# EAGLE design 318_PCB_FOR (EAGLE 7.6.0)
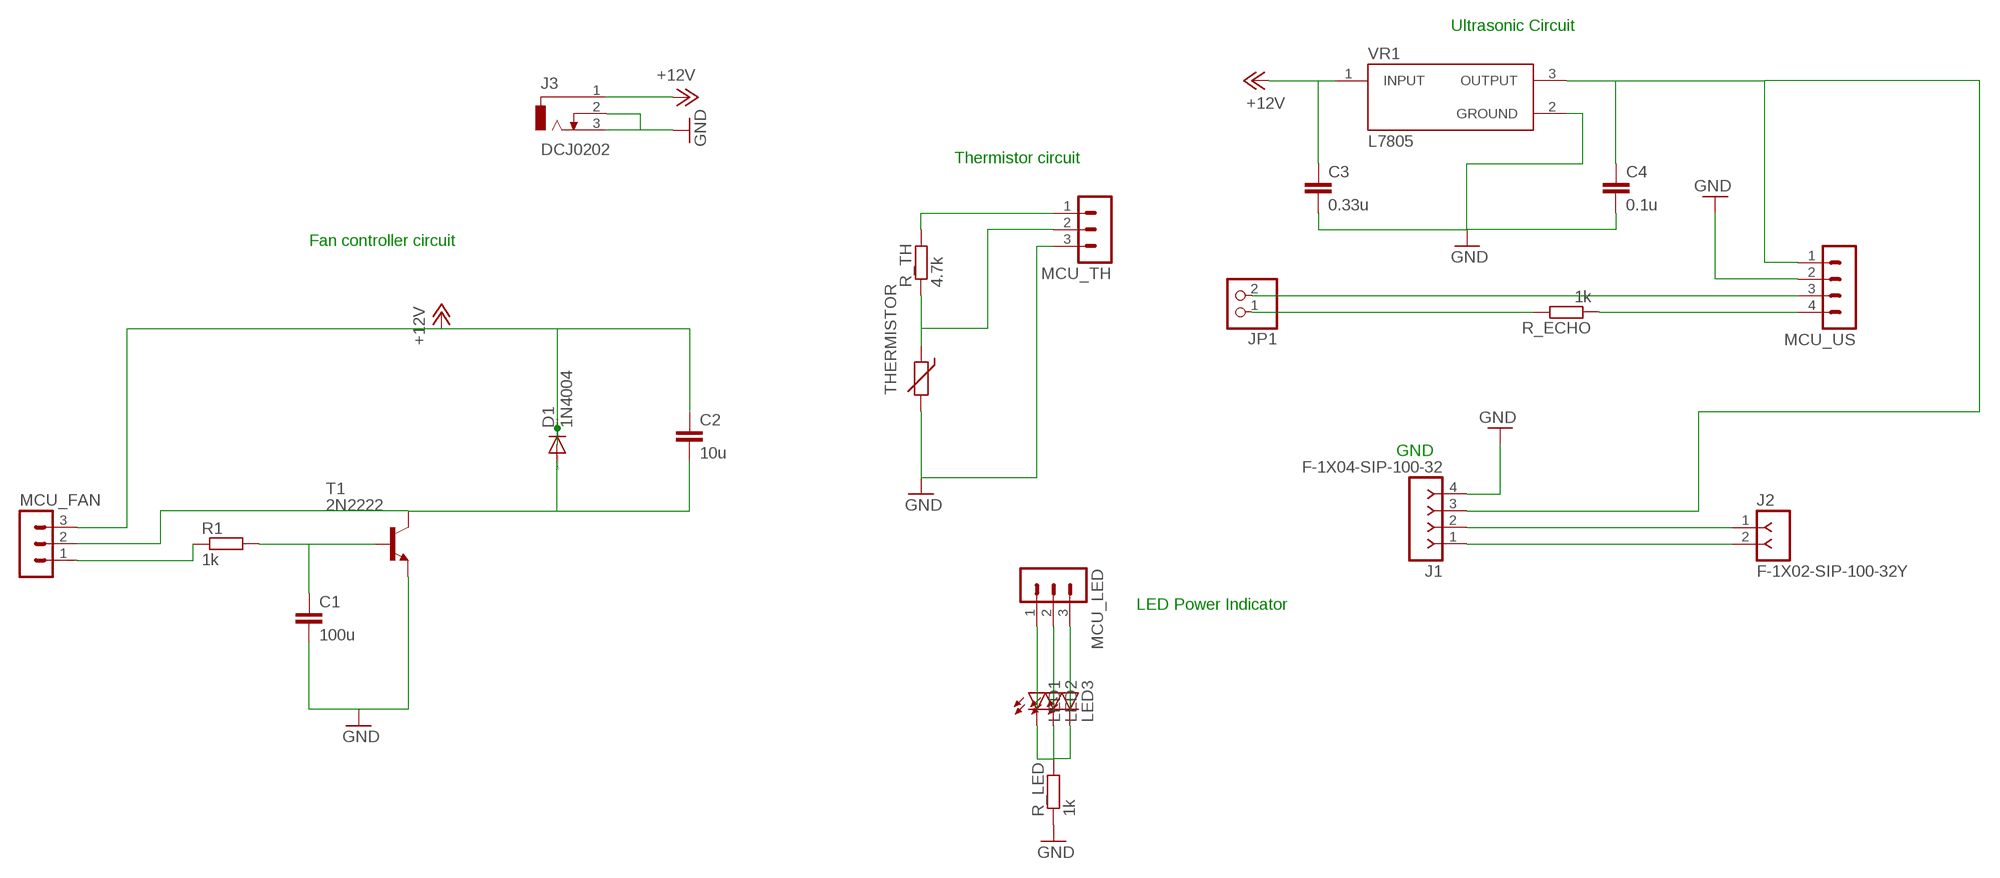
[diagram p0: schematic, sheet 1]

## Parts
C1  100u  C-EU025-025X050  [C025-025X050]
C2  10u  C-EU025-025X050  [C025-025X050]
C3  0.33u  C-EU025-025X050  [C025-025X050]
C4  0.1u  C-EU025-025X050  [C025-025X050]
D1  1N4004  [DO41-10]
J1  F-1X04-SIP-100-32  [SIP-100-04-32]
J2  F-1X02-SIP-100-32Y  [SIP-100-02-32Y]
J3  DCJ0202  [DCJ0202]
JP1  PINHD-1X2  [1X02]
LED1  LEDSFH480  [SFH480]
LED2  LEDSFH480  [SFH480]
LED3  LEDSFH480  [SFH480]
MCU_FAN  MA03-1  [MA03-1]
MCU_LED  MA03-1  [MA03-1]
MCU_TH  MA03-1  [MA03-1]
MCU_US  MA04-1  [MA04-1]
R1  1k  R-EU_0207/10  [0207/10]
R_ECHO  1k  R-EU_0207/10  [0207/10]
R_LED  1k  R-EU_0207/10  [0207/10]
R_TH  4.7k  R-EU_0207/10  [0207/10]
T1  2N2222  [TO18]
THERMISTOR  THERMISTOR-5  [R-5]
VR1  L7805  [TO255P1020X450X2000-3]

## Nets
3V3: MCU_TH.1 R_TH.2
+12V: C2.1 C3.1 D1.C J3.1 MCU_FAN.3 VR1.1(INPUT)
AMBER: LED2.A MCU_LED.2
FAN_BLACK: C2.2 D1.A MCU_FAN.2 T1.3(C)
GND: C1.2 C3.2 C4.2 J1.4 J3.2 J3.3 MCU_TH.3 MCU_US.2 R_LED.1 T1.1(E) THERMISTOR.2 VR1.2(GROUND)
GREEN: LED1.A MCU_LED.1
N$1: C1.1 R1.2 T1.2(B)
N$3: MCU_US.4 R_ECHO.1
N$4: LED1.K(C) LED2.K(C) LED3.K(C) R_LED.2
N$5: JP1.2 MCU_US.3
N$6: C4.1 J1.3 MCU_US.1 VR1.3(OUTPUT)
N$7: JP1.1 R_ECHO.2
N$8: J1.1 J2.2
N$9: J1.2 J2.1
P1.6: MCU_FAN.1 R1.1
P8.1: MCU_TH.2 R_TH.1 THERMISTOR.1
RED: LED3.A MCU_LED.3

## Notes on the sheet
- Ultrasonic Circuit
- Thermistor circuit
- Fan controller circuit
- GND
- LED Power Indicator

## Library data of the parts
C1-C4 = rcl:C-EU: CAPACITOR, European symbol
D1 = diode:1N4004: DIODE general purpose rectifier, 1 A
J1 = con-headers-jp:F-1X04-: FEMALE HEADER
J2 = con-headers-jp:F-1X02-: FEMALE HEADER
J3 = con-jack:DCJ0202: DC POWER JACK Source: DCJ0202.pdf; OC_FARNELL: unknown; OC_NEWARK: unknown
JP1 = pinhead:PINHD-1X2: PIN HEADER
LED1-LED3 = led:LED: LED OSRAM: - CHIPLED LG R971, LG N971, LY N971, LG Q971, LY Q971, LO R971, LY R971 LH N974, LH R974 LS Q976, LO Q976, LY Q976 LO Q996 - Hyper CHIPLED LW Q18S LB Q993, LB Q99A, LB R99A - SideLED LS A670, LO A670, LY A670, LG A670, LP A670 LB A673, LV A673, LT A673, LW A673 LH A674 LY A675 LS A676, LA A676, LO A676, LY A676, LW A676 LS A679, LY A679, LG A679 - Hyper Micro SIDELED® LS Y876, LA Y876, LO Y876, LY Y876 LT Y87S - SmartLED LW L88C, LW L88S LB L89C, LB L89S, LG L890 LS L89K, LO L89K, LY L89K LS L896, LA L896, LO L896, LY L896 - TOPLED LS T670, LO T670, LY T670, LG T670, LP T670 LSG T670, LSP T670, LSY T670, LOP T670, LYG T670 LG T671, LOG T671, LSG T671 LB T673, LV T673, LT T673, LW T673 LH T674 LS T676, LA T676, LO T676, LY T676, LB T676, LH T676, LSB T676, LW T676 LB T67C, LV T67C, LT T67C, LS T67K, LO T67K, LY T67K, LW E67C LS E67B, LA E67B, LO E67B, LY E67B, LB E67C, LV E67C, LT E67C LW T67C LS T679, LY T679, LG T679 LS T770, LO T770, LY T770, LG T770, LP T770 LB T773, LV T773, LT T773, LW T773 LH T774 LS E675, LA E675, LY E675, LS T675 LS T776, LA T776, LO T776, LY T776, LB T776 LHGB T686 LT T68C, LB T68C - Hyper Mini TOPLED® LB M676 - Mini TOPLED Santana® LG M470 LS M47K, LO M47K, LY M47K Source: http://www.osram.convergy.de LUXEON: - LUMILED® LXK2-PW12-R00, LXK2-PW12-S00, LXK2-PW14-U00, LXK2-PW14-V00 LXK2-PM12-R00, LXK2-PM12-S00, LXK2-PM14-U00 LXK2-PE12-Q00, LXK2-PE12-R00, LXK2-PE12-S00, LXK2-PE14-T00, LXK2-PE14-U00 LXK2-PB12-K00, LXK2-PB12-L00, LXK2-PB12-M00, LXK2-PB14-N00, LXK2-PB14-P00, LXK2-PB14-Q00 LXK2-PR12-L00, LXK2-PR12-M00, LXK2-PR14-Q00, LXK2-PR14-R00 LXK2-PD12-Q00, LXK2-PD12-R00, LXK2-PD12-S00 LXK2-PH12-R00, LXK2-PH12-S00 LXK2-PL12-P00, LXK2-PL12-Q00, LXK2-PL12-R00 Source: www.luxeon.com KINGBRIGHT: KA-3528ASYC Source: www.kingbright.com
MCU_FAN MCU_LED MCU_TH = con-lstb:MA03-1: PIN HEADER; OC_FARNELL: unknown; OC_NEWARK: unknown
MCU_US = con-lstb:MA04-1: PIN HEADER; OC_FARNELL: unknown; OC_NEWARK: unknown
R1 R_ECHO R_LED R_TH = rcl:R-EU_: RESISTOR, European symbol
T1 = transistor-neu-to92:2N2222: NPN TRANSISTOR
THERMISTOR = varistor:THERMISTOR: THERMISTOR
VR1 = L7805:L7805: Check availability <https://pricing.snapeda.com/parts/L7805/STMicroelectronics/view-part?ref=eda>; AVAILABILITY: In Stock; CHECK_PRICES: https://www.snapeda.com/parts/L7805/STMicroelectronics/view-part/?ref=eda; DESCRIPTION: Standard Regulator Pos 5V 1.5A 3-Pin(3+Tab) TO-220FP Tube; MF: STMicroelectronics; MP: L7805; PACKAGE: None; PRICE: None; SNAPEDA_LINK: https://www.snapeda.com/parts/L7805/STMicroelectronics/view-part/?ref=snap

## Board
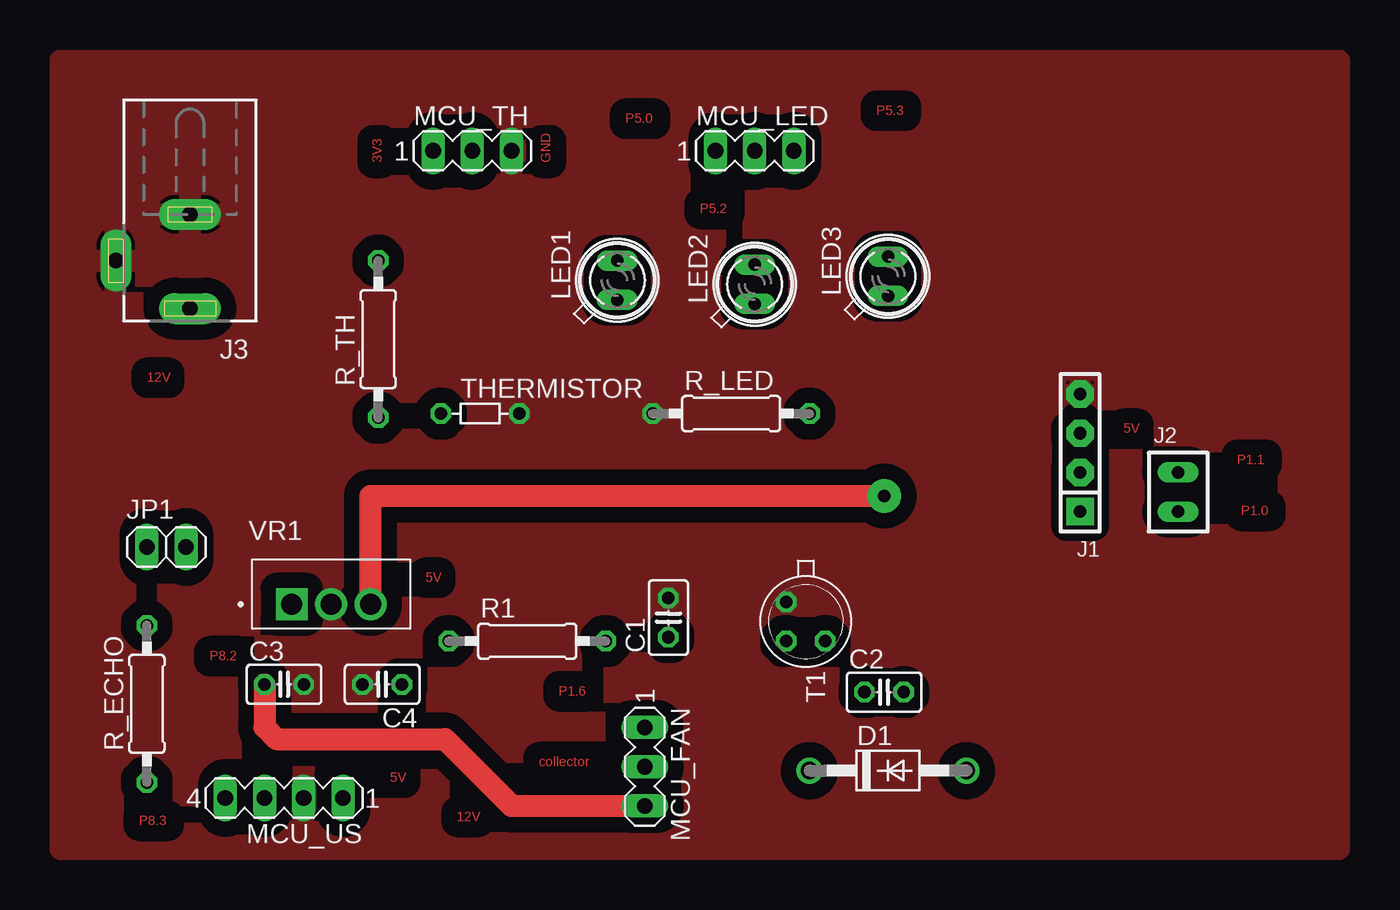
[diagram p1: board, top side]
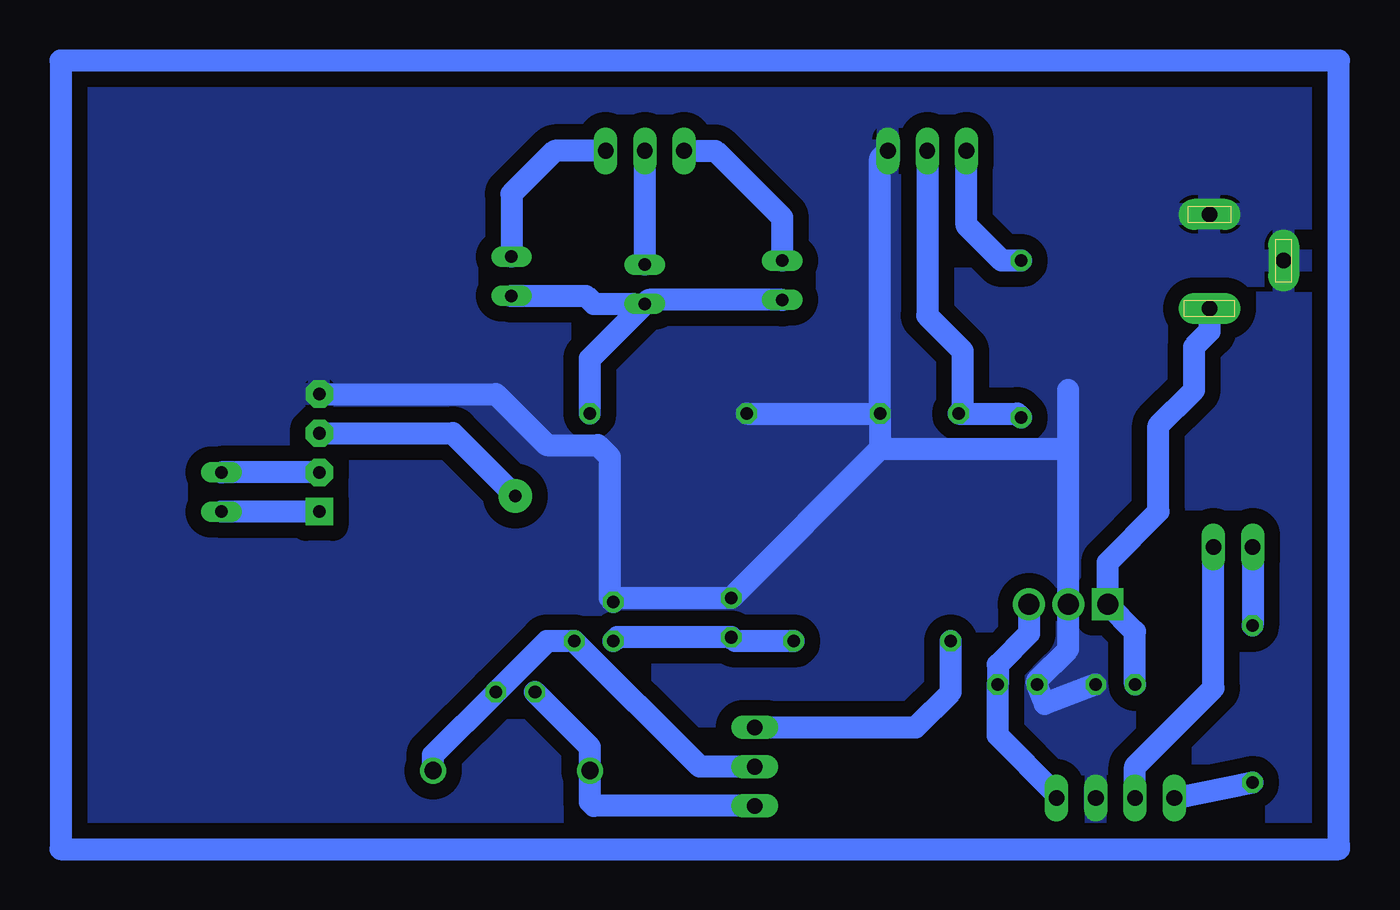
[diagram p2: board, bottom side, seen from below]

No outline drawn. Coordinates in mm, seen from the top.
Copper layers (1*16): Top 0.035mm / dielectric 1.5mm / Bottom 0.035mm
Design rules "default *": minimum track width 10mil, minimum drill 24mil, track to track 1mm, track to pad 1mm, pad to pad 1mm, via to via 1mm, smd to smd 8mil, copper to edge 40mil, drill to drill 8mil, minimum pad ring 10mil, minimum via ring 8mil, stop-mask expansion 4mil, vias tented up to drill 0mil, thermal gap 10mil

### Footprints (pad centres in the part's own frame; a part is rotated, then mirrored left to right if it is on the bottom)
C025-025X050 = drill 0.813 octagon: 1 -1.27,0; 2 1.27,0
DO41-10 = drill 1.118: A 5.08,0; C -5.08,0
SIP-100-04-32 = drill 0.813 pad 1.778 square: 1 -3.81,0 | drill 0.813 pad 1.778 octagon: 2 -1.27,0; 3 1.27,0; 4 3.81,0
SIP-100-02-32Y = drill 0.813 long: 1 -1.27,0; 2 1.27,0
DCJ0202 = drill 1 pad 2 long: 1 0,3.1; 2 4.8,0; 3 0,-3
1X02 = drill 1.016 long: 1 -1.27,0; 2 1.27,0
SFH480 = drill 0.813 long: A 1.27,0; K -1.27,0
MA03-1 = drill 1.016 long: 1 -2.54,0; 2 0,0; 3 2.54,0
MA04-1 = drill 1.016 long: 1 -3.81,0; 2 -1.27,0; 3 1.27,0; 4 3.81,0
0207/10 = drill 0.813 octagon: 1 -5.08,0; 2 5.08,0
TO18 = drill 0.813 octagon: 1 -1.27,-1.27; 2 1.27,-1.27; 3 1.27,1.27
R-5 = drill 0.813 octagon: 1 -2.54,0; 2 2.54,0
TO255P1020X450X2000-3 = drill 1.37 square: 1 -2.55,-0.662 | drill 1.37: 2 0,-0.662; 3 2.55,-0.662

### Placement (x,y rotation side)
C1  39.37,14.99 90 top
C2  53.34,10.16 0 top
C3  14.48,10.67 0 top
C4  20.83,10.67 180 top
D1  53.59,5.08 0 top
J1  66.04,25.65 90 top
J2  72.39,23.11 270 top
J3  8.38,38.1 180 top
JP1  6.86,19.56 0 top
LED1  36.07,36.83 90 top
LED2  44.96,36.58 90 top
LED3  53.59,37.08 90 top
MCU_FAN  37.85,5.33 270 top
MCU_LED  44.96,45.21 0 top
MCU_TH  26.67,45.21 0 top
MCU_US  14.48,3.3 180 top
R1  30.23,13.46 0 top
R_ECHO  5.59,9.4 90 top
R_LED  43.43,28.19 0 top
R_TH  20.57,33.02 90 top
T1  48.26,14.73 270 top
THERMISTOR  27.18,28.19 0 top
VR1  17.53,16.51 0 top

### Tracks (layer width: path | path; a pad name or v marks a point on that pad's centre or on a via)
3V3
  Bottom 1.422: R_TH.2 21.84,38.1 24.13,40.39 MCU_TH.1
+12V
  Top 1.422: C3.1 13.21,7.87 13.97,7.11 24.89,7.11 29.21,2.79 MCU_FAN.3
  Bottom 1.422: C3.1 13.21,14.08 VR1.1 14.98,18.55 11.68,21.84 11.68,27.43 9.53,29.59 9.4,29.72 9.4,32.51 8.38,33.53 J3.1 | MCU_FAN.3 48.26,2.79 48.51,3.05 D1.C 48.51,6.6 C2.1
AMBER
  Bottom 1.422: LED2.A MCU_LED.2
FAN_BLACK
  Bottom 1.422: MCU_FAN.2 41.4,5.33 T1.3 51.31,13.46 C2.2 58.67,6.1 D1.A
GND
  Bottom 1.422: THERMISTOR.2 29.72,25.91 | 29.72,25.91 C1.2 46.74,16.26 T1.1 47.24,16.26 47.24,25.4 48.01,26.16 51.31,26.16 54.61,29.46 J1.4 | THERMISTOR.2 29.72,44.7 MCU_TH.3 | 29.72,25.91 17.78,25.91 17.53,25.65 | R_LED.1 THERMISTOR.2 | 17.53,25.65 17.53,29.72 | C3.2 19.05,9.4 C4.2 19.56,10.92 17.53,12.95 VR1.2 17.53,25.65
  pour Bottom: 0,0 0,51.05 82.8,51.05 82.8,0
  pour Top: 0,0 0,51.05 82.8,51.05 82.8,0
  pour Bottom: 0,0 0,51.05 82.8,51.05 82.8,0
  pour Bottom: 0,0 0,51.05 82.8,51.05 82.8,0
  pour Bottom: 0,0 0,51.05 82.8,51.05 82.8,0
  pour Bottom: 0,0 0,51.05 82.8,51.05 82.8,0
GREEN
  Bottom 1.422: MCU_LED.1 40.39,45.21 36.07,40.89 LED1.A
N$1
  Bottom 1.422: R1.2 39.12,13.46 C1.1 46.74,13.72 T1.2
N$2
  Bottom 1.422: 0,0.25 0,51.05 82.8,51.05 82.8,0 0,0 0,0.25
N$3
  Bottom 1.422: MCU_US.4 R_ECHO.1
N$4
  Bottom 1.422: R_LED.2 48.51,31.75 45.34,34.92 | 45.34,34.92 LED2.K 44.7,35.56 LED1.K | LED3.K 48.77,35.81 48.26,35.31 45.72,35.31 45.34,34.92
N$5
  Bottom 1.422: MCU_US.3 13.21,5.33 8.13,10.41 JP1.2
N$6  (via drill 0.8 pad 2.18)
  Top 1.422: v53.34,22.86 20.07,22.86 20.07,15.86 VR1.3
  Bottom 1.422: VR1.3 20.08,13.96 22.1,11.94 C4.1 22.1,7.37 18.29,3.56 MCU_US.1 | J1.3 57.4,26.92 v53.34,22.86
N$7
  Bottom 1.422: JP1.1 R_ECHO.2
N$8
  Bottom 1.422: J1.1 J2.2
N$9
  Bottom 1.422: J1.2 J2.1
P1.6
  Bottom 1.422: MCU_FAN.1 27.43,7.87 25.15,10.16 R1.1
P8.1
  Bottom 1.422: R_TH.1 20.83,28.19 THERMISTOR.1 24.38,28.45 24.38,32.26 26.67,34.54 MCU_TH.2
RED
  Bottom 1.422: MCU_LED.3 50.8,45.21 53.59,42.42 LED3.A

### Text on the board
Top: P5.0 | P5.3 | 3V3 | GND | P5.2 | 12V | 5V | P1.1 | P1.0 | 5V | P8.2 | P1.6 | collector | 5V | P8.3 | 12V